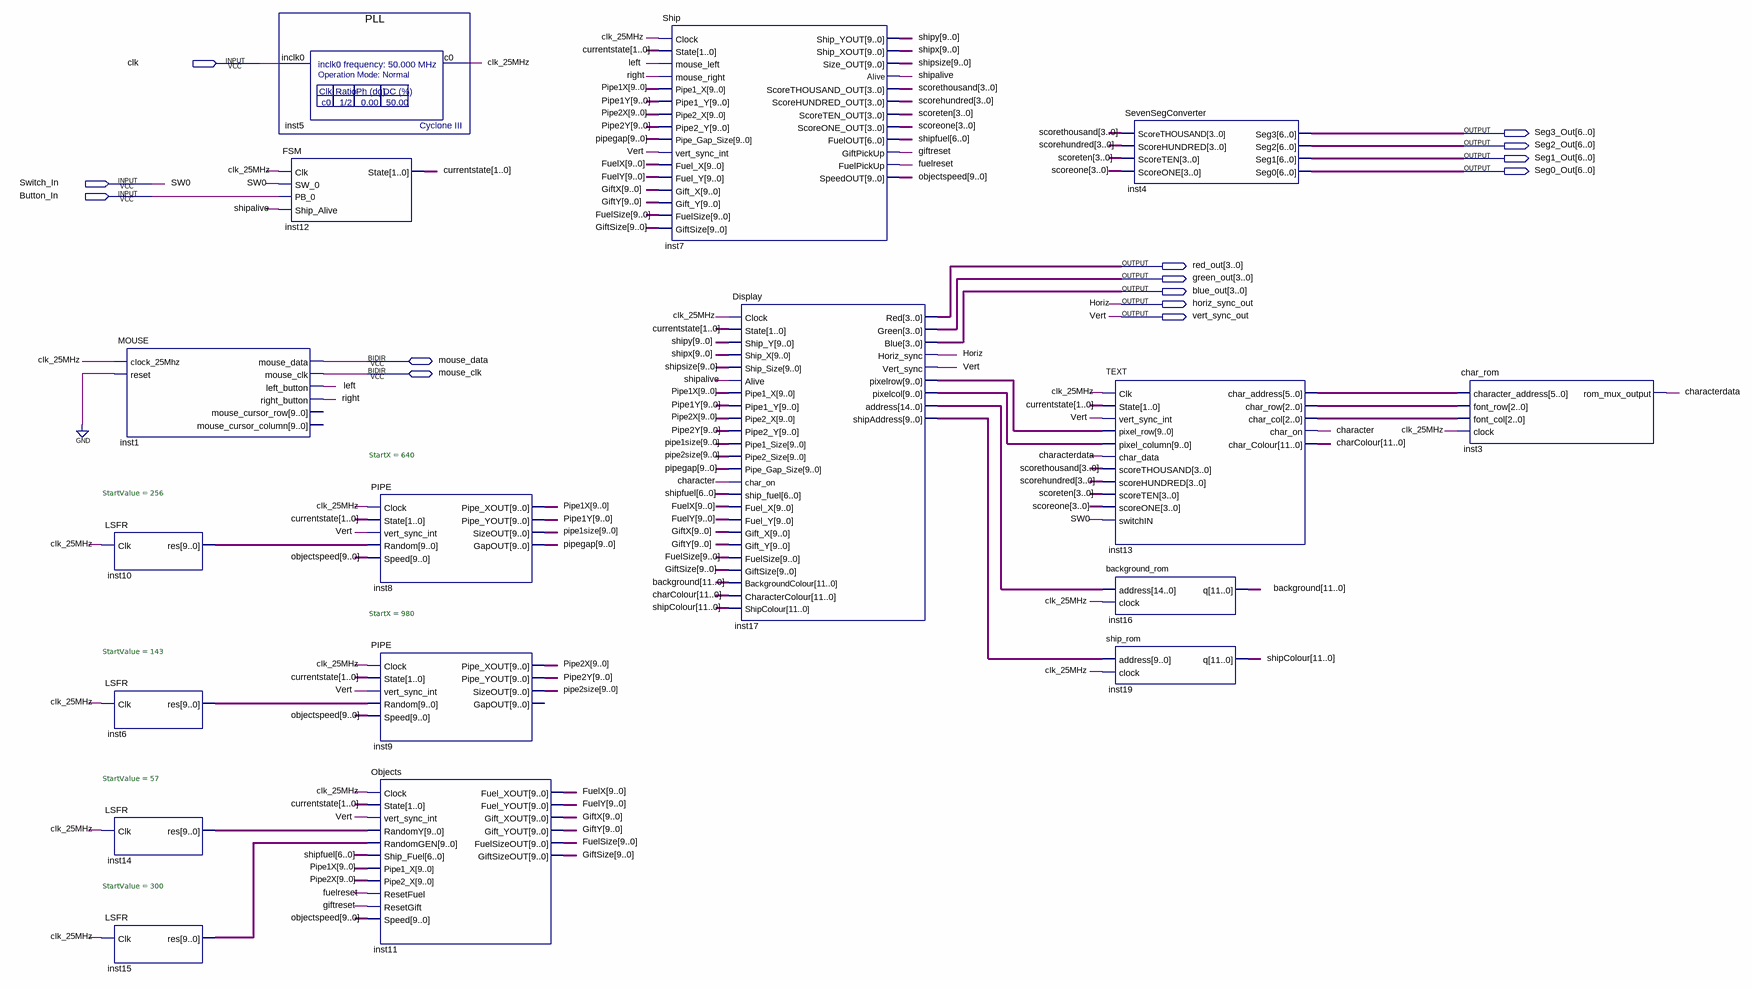
[diagram p0: schematic sheet]
// Quartus schematic miniProject.bdf as structural Verilog: 17 symbols, 14 pins
module miniProject (
  input  clk,
  input  Switch_In,
  input  Button_In,
  inout  mouse_data,
  inout  mouse_clk,
  output [6:0] Seg3_Out,
  output [6:0] Seg2_Out,
  output [6:0] Seg1_Out,
  output [6:0] Seg0_Out,
  output [3:0] red_out,
  output [3:0] green_out,
  output [3:0] blue_out,
  output horiz_sync_out,
  output vert_sync_out
);

  wire character, characterdata, clk_25MHz, fuelreset, giftreset, left, right, shipalive;
  wire [1:0] currentstate;
  wire [2:0] inst13_char_col, inst13_char_row;
  wire [3:0] scorehundred, scoreone, scoreten, scorethousand;
  wire [5:0] inst13_char_address;
  wire [6:0] shipfuel;
  wire [9:0] FuelSize, FuelX, FuelY, GiftSize, GiftX, GiftY, inst6_res, inst10_res, inst14_res, inst15_res,
       inst17_pixelcol, inst17_pixelrow, inst17_shipaddress, objectspeed, pipe1size, Pipe1X, Pipe1Y,
       pipe2size, Pipe2X, Pipe2Y, pipegap, shipsize, shipx, shipy;
  wire [11:0] background, charColour, shipColour;
  wire [14:0] inst17_address;

  MOUSE inst1 (
    .clock_25Mhz(clk_25MHz), .reset(1'b0), .left_button(left), .right_button(right), .mouse_data(mouse_data),
    .mouse_clk(mouse_clk));  // open: mouse_cursor_row, mouse_cursor_column
  LSFR #(.StartValue(256)) inst10 (.Clk(clk_25MHz), .res(inst10_res));
  LSFR #(.StartValue(143)) inst6 (.Clk(clk_25MHz), .res(inst6_res));
  LSFR #(.StartValue(57)) inst14 (.Clk(clk_25MHz), .res(inst14_res));
  LSFR #(.StartValue(300)) inst15 (.Clk(clk_25MHz), .res(inst15_res));
  PLL inst5 (.inclk0(clk), .c0(clk_25MHz));
  FSM inst12 (.Clk(clk_25MHz), .SW_0(Switch_In), .PB_0(Button_In), .Ship_Alive(shipalive), .State(currentstate));
  PIPE #(.StartX(640)) inst8 (
    .Clock(clk_25MHz), .State(currentstate), .vert_sync_int(vert_sync_out), .Random(inst10_res),
    .Speed(objectspeed), .Pipe_XOUT(Pipe1X), .Pipe_YOUT(Pipe1Y), .SizeOUT(pipe1size), .GapOUT(pipegap));
  PIPE #(.StartX(980)) inst9 (
    .Clock(clk_25MHz), .State(currentstate), .vert_sync_int(vert_sync_out), .Random(inst6_res),
    .Speed(objectspeed), .Pipe_XOUT(Pipe2X), .Pipe_YOUT(Pipe2Y), .SizeOUT(pipe2size));  // open: GapOUT
  Objects inst11 (
    .Clock(clk_25MHz), .State(currentstate), .vert_sync_int(vert_sync_out), .RandomY(inst14_res),
    .RandomGEN(inst15_res), .Ship_Fuel(shipfuel), .Pipe1_X(Pipe1X), .Pipe2_X(Pipe2X), .ResetFuel(fuelreset),
    .ResetGift(giftreset), .Speed(objectspeed), .Fuel_XOUT(FuelX), .Fuel_YOUT(FuelY), .Gift_XOUT(GiftX),
    .Gift_YOUT(GiftY), .FuelSizeOUT(FuelSize), .GiftSizeOUT(GiftSize));
  Ship inst7 (
    .Clock(clk_25MHz), .State(currentstate), .mouse_left(left), .mouse_right(right), .Pipe1_X(Pipe1X),
    .Pipe1_Y(Pipe1Y), .Pipe2_X(Pipe2X), .Pipe2_Y(Pipe2Y), .Pipe_Gap_Size(pipegap),
    .vert_sync_int(vert_sync_out), .Fuel_X(FuelX), .Fuel_Y(FuelY), .Gift_X(GiftX), .Gift_Y(GiftY),
    .FuelSize(FuelSize), .GiftSize(GiftSize), .Ship_YOUT(shipy), .Ship_XOUT(shipx), .Size_OUT(shipsize),
    .Alive(shipalive), .ScoreTHOUSAND_OUT(scorethousand), .ScoreHUNDRED_OUT(scorehundred),
    .ScoreTEN_OUT(scoreten), .ScoreONE_OUT(scoreone), .FuelOUT(shipfuel), .GiftPickUp(giftreset),
    .FuelPickUp(fuelreset), .SpeedOUT(objectspeed));
  Display inst17 (
    .Clock(clk_25MHz), .State(currentstate), .Ship_Y(shipy), .Ship_X(shipx), .Ship_Size(shipsize),
    .Alive(shipalive), .Pipe1_X(Pipe1X), .Pipe1_Y(Pipe1Y), .Pipe2_X(Pipe2X), .Pipe2_Y(Pipe2Y),
    .Pipe1_Size(pipe1size), .Pipe2_Size(pipe2size), .Pipe_Gap_Size(pipegap), .char_on(character),
    .ship_fuel(shipfuel), .Fuel_X(FuelX), .Fuel_Y(FuelY), .Gift_X(GiftX), .Gift_Y(GiftY),
    .FuelSize(FuelSize), .GiftSize(GiftSize), .BackgroundColour(background), .CharacterColour(charColour),
    .ShipColour(shipColour), .Red(red_out), .Green(green_out), .Blue(blue_out), .Horiz_sync(horiz_sync_out),
    .Vert_sync(vert_sync_out), .pixelrow(inst17_pixelrow), .pixelcol(inst17_pixelcol),
    .address(inst17_address), .shipAddress(inst17_shipaddress));
  TEXT inst13 (
    .Clk(clk_25MHz), .State(currentstate), .vert_sync_int(vert_sync_out), .pixel_row(inst17_pixelrow),
    .pixel_column(inst17_pixelcol), .char_data(characterdata), .scoreTHOUSAND(scorethousand),
    .scoreHUNDRED(scorehundred), .scoreTEN(scoreten), .scoreONE(scoreone), .switchIN(Switch_In),
    .char_address(inst13_char_address), .char_row(inst13_char_row), .char_col(inst13_char_col),
    .char_on(character), .char_Colour(charColour));
  background_rom inst16 (.address(inst17_address), .clock(clk_25MHz), .q(background));
  ship_rom inst19 (.address(inst17_shipaddress), .clock(clk_25MHz), .q(shipColour));
  SevenSegConverter inst4 (
    .ScoreTHOUSAND(scorethousand), .ScoreHUNDRED(scorehundred), .ScoreTEN(scoreten), .ScoreONE(scoreone),
    .Seg3(Seg3_Out), .Seg2(Seg2_Out), .Seg1(Seg1_Out), .Seg0(Seg0_Out));
  char_rom inst3 (
    .character_address(inst13_char_address), .font_row(inst13_char_row), .font_col(inst13_char_col),
    .clock(clk_25MHz), .rom_mux_output(characterdata));

  // Other names for the same wires on the sheet: Horiz = horiz_sync_out; SW0 = Switch_In; Vert = vert_sync_out
endmodule
